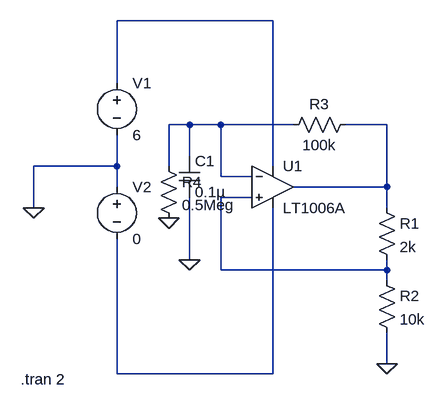
[diagram p0: schematic negative_charge_pump_square_wave.asc]
negative_charge_pump_square_wave.asc, the LTspice schematic file:
Version 4
SHEET 1 880 680
WIRE 176 -80 -64 -80
WIRE -64 16 -64 -80
WIRE 48 80 16 80
WIRE 96 80 48 80
WIRE 208 80 96 80
WIRE 352 80 288 80
WIRE 48 128 48 80
WIRE -64 144 -64 96
WIRE -64 144 -192 144
WIRE 16 144 16 80
WIRE 176 144 176 -80
WIRE 96 160 96 80
WIRE 144 160 96 160
WIRE -64 176 -64 144
WIRE 352 176 352 80
WIRE 352 176 208 176
WIRE 144 192 96 192
WIRE -192 208 -192 144
WIRE 352 208 352 176
WIRE 48 288 48 192
WIRE 96 304 96 192
WIRE 352 304 352 288
WIRE 352 304 96 304
WIRE 352 320 352 304
WIRE 352 448 352 400
WIRE -64 464 -64 256
WIRE 176 464 176 208
WIRE 176 464 -64 464
FLAG -192 208 0
FLAG 352 448 0
FLAG 48 288 0
FLAG 16 224 0
SYMBOL OpAmps\\LT1006A 176 112 R0
SYMATTR InstName U1
SYMBOL voltage -64 0 R0
WINDOW 123 0 0 Left 0
WINDOW 39 0 0 Left 0
SYMATTR InstName V1
SYMATTR Value 6
SYMBOL voltage -64 160 R0
WINDOW 123 0 0 Left 0
WINDOW 39 0 0 Left 0
SYMATTR InstName V2
SYMATTR Value 0
SYMBOL res 336 192 R0
SYMATTR InstName R1
SYMATTR Value 2k
SYMBOL res 336 304 R0
SYMATTR InstName R2
SYMATTR Value 10k
SYMBOL cap 32 128 R0
SYMATTR InstName C1
SYMATTR Value 0.1µ
SYMBOL res 304 64 R90
WINDOW 0 0 56 VBottom 2
WINDOW 3 32 56 VTop 2
SYMATTR InstName R3
SYMATTR Value 100k
SYMBOL res 0 128 R0
SYMATTR InstName R4
SYMATTR Value 0.5Meg
TEXT -212 472 Left 2 !.tran 2

The netlist it stands for:
* negative_charge_pump_square_wave.asc
XU1 N004 N002 N001 N005 N003 LT1006A  ; pins In+ In- V+ V- OUT
V1 N001 0 6
V2 0 N005 0
R1 N003 N004 2k
R2 N004 0 10k
C1 N002 0 0.1µ
R3 N003 N002 100k
R4 N002 0 0.5Meg
.tran 2
.backanno
.end